# EAGLE design CMoy-Pro-V_1_0_0_2a (EAGLE 6.4)
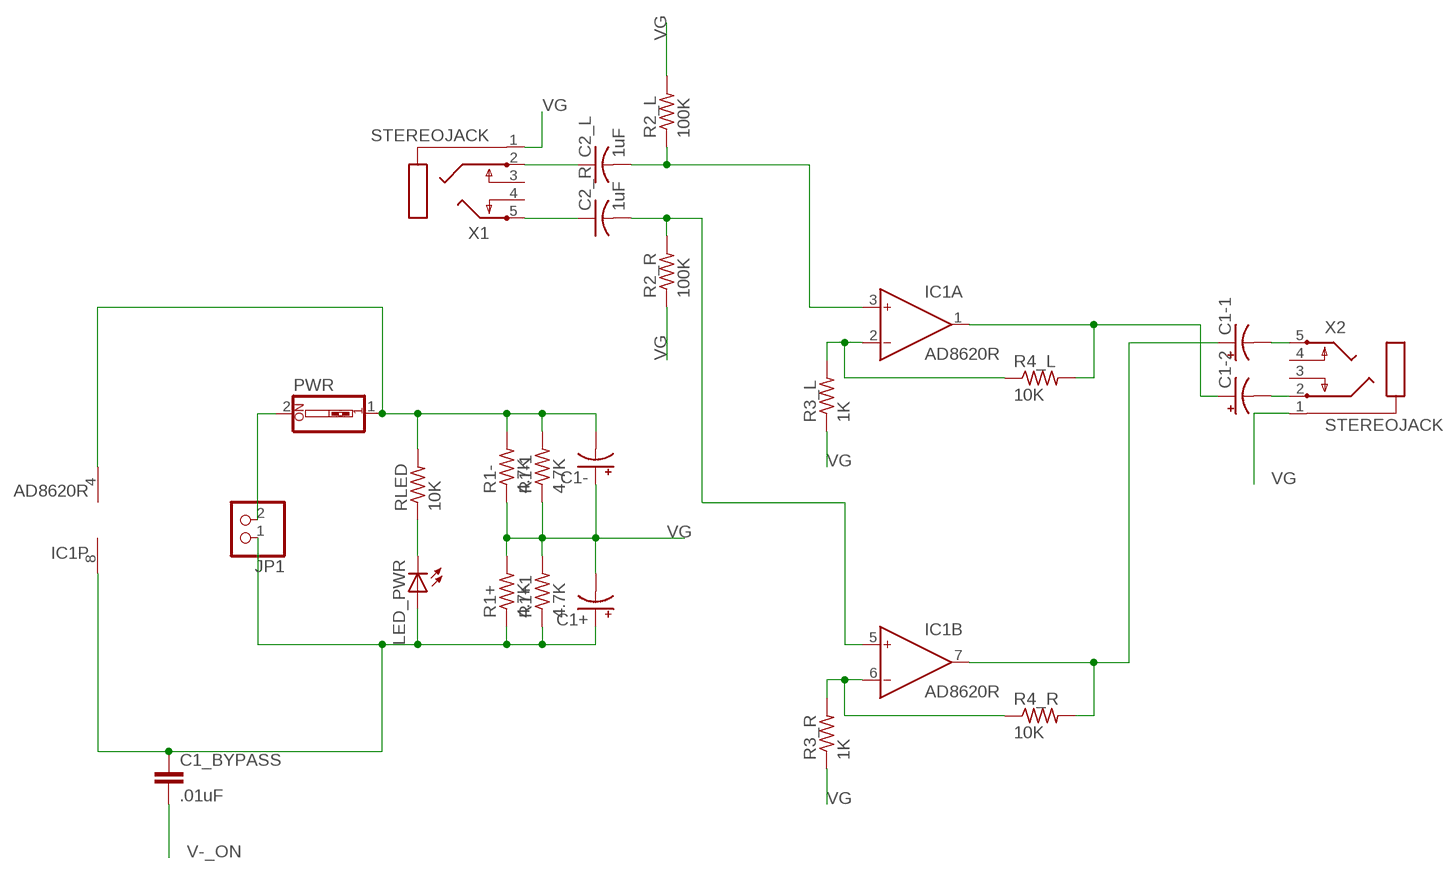
[diagram p0: schematic, sheet 1]

## Parts
C1+  CPOL-USE7.5-16  [E7,5-16]
C1-  CPOL-USE7.5-16  [E7,5-16]
C1-1  CPOL-USE7.5-16  [E7,5-16]
C1-2  CPOL-USE7.5-16  [E7,5-16]
C1_BYPASS  .01uF  C-EUC0402  [C0402]
C2_L  1uF  C-US075-042X103  [C075-042X103]
C2_R  1uF  C-US075-042X103  [C075-042X103]
IC1  AD8620R  [SO8]
JP1  PINHD-1X2  [1X02]
LED_PWR  LED3MM  [LED3MM]
PWR  SW_DIP-1  [EDG-01]
R1+  4.7K  R-US_0207/7  [0207/7]
R1+1  4.7K  R-US_0207/7  [0207/7]
R1-  4.7K  R-US_0207/7  [0207/7]
R1-1  4.7K  R-US_0207/7  [0207/7]
R2_L  100K  R-US_0207/7  [0207/7]
R2_R  100K  R-US_0207/7  [0207/7]
R3_L  1K  R-US_0207/7  [0207/7]
R3_R  1K  R-US_0207/7  [0207/7]
R4_L  10K  R-US_0207/7  [0207/7]
R4_R  10K  R-US_0207/7  [0207/7]
RLED  10K  R-US_0207/7  [0207/7]
X1  STEREOJACK  [STX3100]
X2  STEREOJACK  [STX3100]

## Nets
IN_R: C2_R.2 IC1.5(B:IN+) R2_R.2
N$1: C2_L.2 IC1.3(A:IN+) R2_L.1
N$2: C1-2.- X2.2
N$3: LED_PWR.K(C) RLED.1
N$4: C2_L.1 X1.2
N$5: IC1.2(A:IN-) R3_L.2 R4_L.1
N$6: IC1.6(B:IN-) R3_R.2 R4_R.1
N$7: C2_R.1 X1.5
N$8: C1-1.- X2.5
OUT_L: C1-2.+ IC1.1(A:OUT) R4_L.2
OUT_R: C1-1.+ IC1.7(B:OUT) R4_R.2
V+: C1+.+ C1_BYPASS.1 IC1.8(P:V+) JP1.1 LED_PWR.A R1+1.1 R1+.1
V-: JP1.2 PWR.2
V-_ON: C1-.- C1_BYPASS.2 IC1.4(P:V-) PWR.1 R1-1.2 R1-.2 RLED.2
VG: C1+.- C1-.+ R1+1.2 R1+.2 R1-1.1 R1-.1 R2_L.2 R2_R.1 R3_L.1 R3_R.1 X1.1 X2.1
Unconnected: X1.3 X1.4 X2.3 X2.4

## Library data of the parts
C1+ C1- C1-1 C1-2 = rcl:CPOL-US: POLARIZED CAPACITOR, American symbol
C1_BYPASS = rcl:C-EU: CAPACITOR, European symbol
C2_L C2_R = rcl:C-US: CAPACITOR, American symbol
IC1 = analog-devices:AD8620: Precision, Very Low Noise, Low Input Bias Current, Wide Bandwidth JFET Operational Amplifiers Source: http://www.analog.com/static/imported-files/data_sheets/AD8610_8620.pdf; MF: ALTERA CORPORATION; MPN: AD8620ARZ; OC_FARNELL: 9994386; OC_NEWARK: 59K6972
JP1 = pinhead:PINHD-1X2: PIN HEADER
LED_PWR = adafruit:LED: LED OSRAM: - CHIPLED LG R971, LG N971, LY N971, LG Q971, LY Q971, LO R971, LY R971 LH N974, LH R974 LS Q976, LO Q976, LY Q976 LO Q996 - Hyper CHIPLED LW Q18S LB Q993, LB Q99A, LB R99A - SideLED LS A670, LO A670, LY A670, LG A670, LP A670 LB A673, LV A673, LT A673, LW A673 LH A674 LY A675 LS A676, LA A676, LO A676, LY A676, LW A676 LS A679, LY A679, LG A679 - Hyper Micro SIDELED® LS Y876, LA Y876, LO Y876, LY Y876 LT Y87S - SmartLED LW L88C, LW L88S LB L89C, LB L89S, LG L890 LS L89K, LO L89K, LY L89K LS L896, LA L896, LO L896, LY L896 - TOPLED LS T670, LO T670, LY T670, LG T670, LP T670 LSG T670, LSP T670, LSY T670, LOP T670, LYG T670 LG T671, LOG T671, LSG T671 LB T673, LV T673, LT T673, LW T673 LH T674 LS T676, LA T676, LO T676, LY T676, LB T676, LH T676, LSB T676, LW T676 LB T67C, LV T67C, LT T67C, LS T67K, LO T67K, LY T67K, LW E67C LS E67B, LA E67B, LO E67B, LY E67B, LB E67C, LV E67C, LT E67C LW T67C LS T679, LY T679, LG T679 LS T770, LO T770, LY T770, LG T770, LP T770 LB T773, LV T773, LT T773, LW T773 LH T774 LS E675, LA E675, LY E675, LS T675 LS T776, LA T776, LO T776, LY T776, LB T776 LHGB T686 LT T68C, LB T68C - Hyper Mini TOPLED® LB M676 - Mini TOPLED Santana® LG M470 LS M47K, LO M47K, LY M47K Source: http://www.osram.convergy.de/
PWR = special:SW_DIP-1: DIP SWITCH
R1+ R1+1 R1- R1-1 R2_L R2_R R3_L R3_R R4_L R4_R RLED = rcl:R-US_: RESISTOR, American symbol
X1 X2 = adafruit:STEREOJACK: MIC/HEADPHONE JACK Stereo jack with two switches. Kycon STX3100, CUI SJ1-3555NG and/or 4UCon 05544

## Board
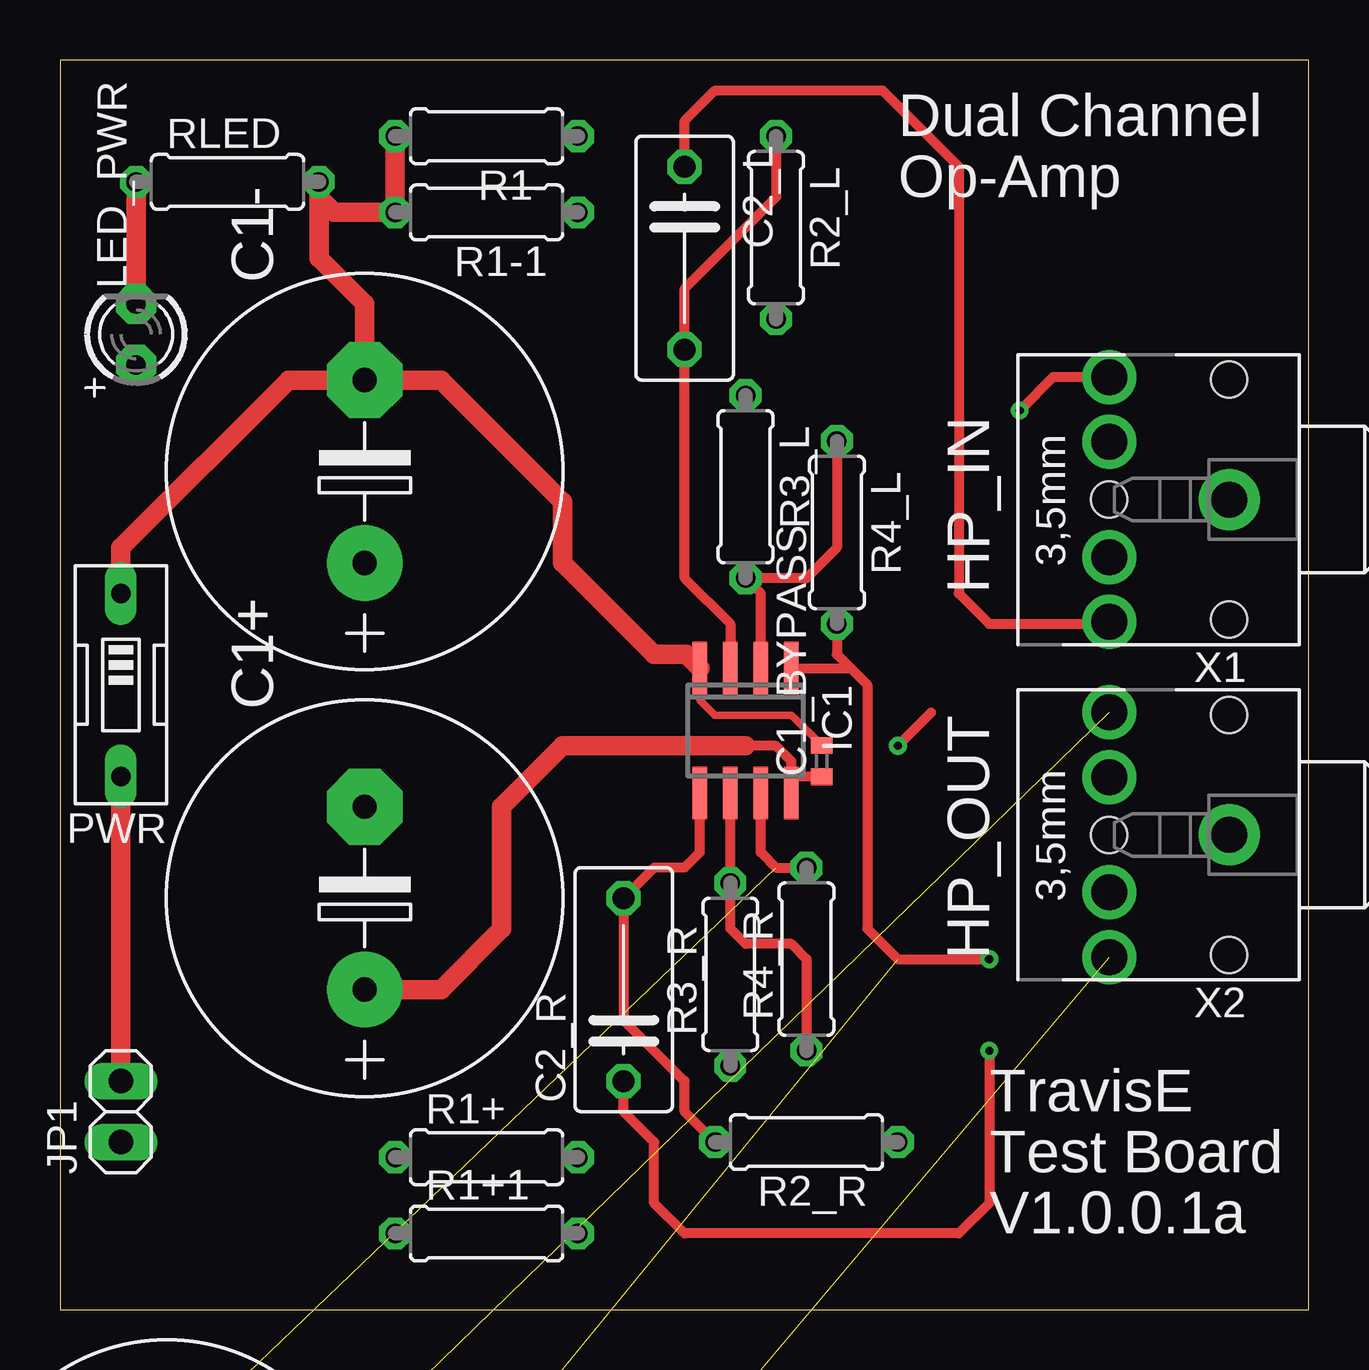
[diagram p1: board, top side]
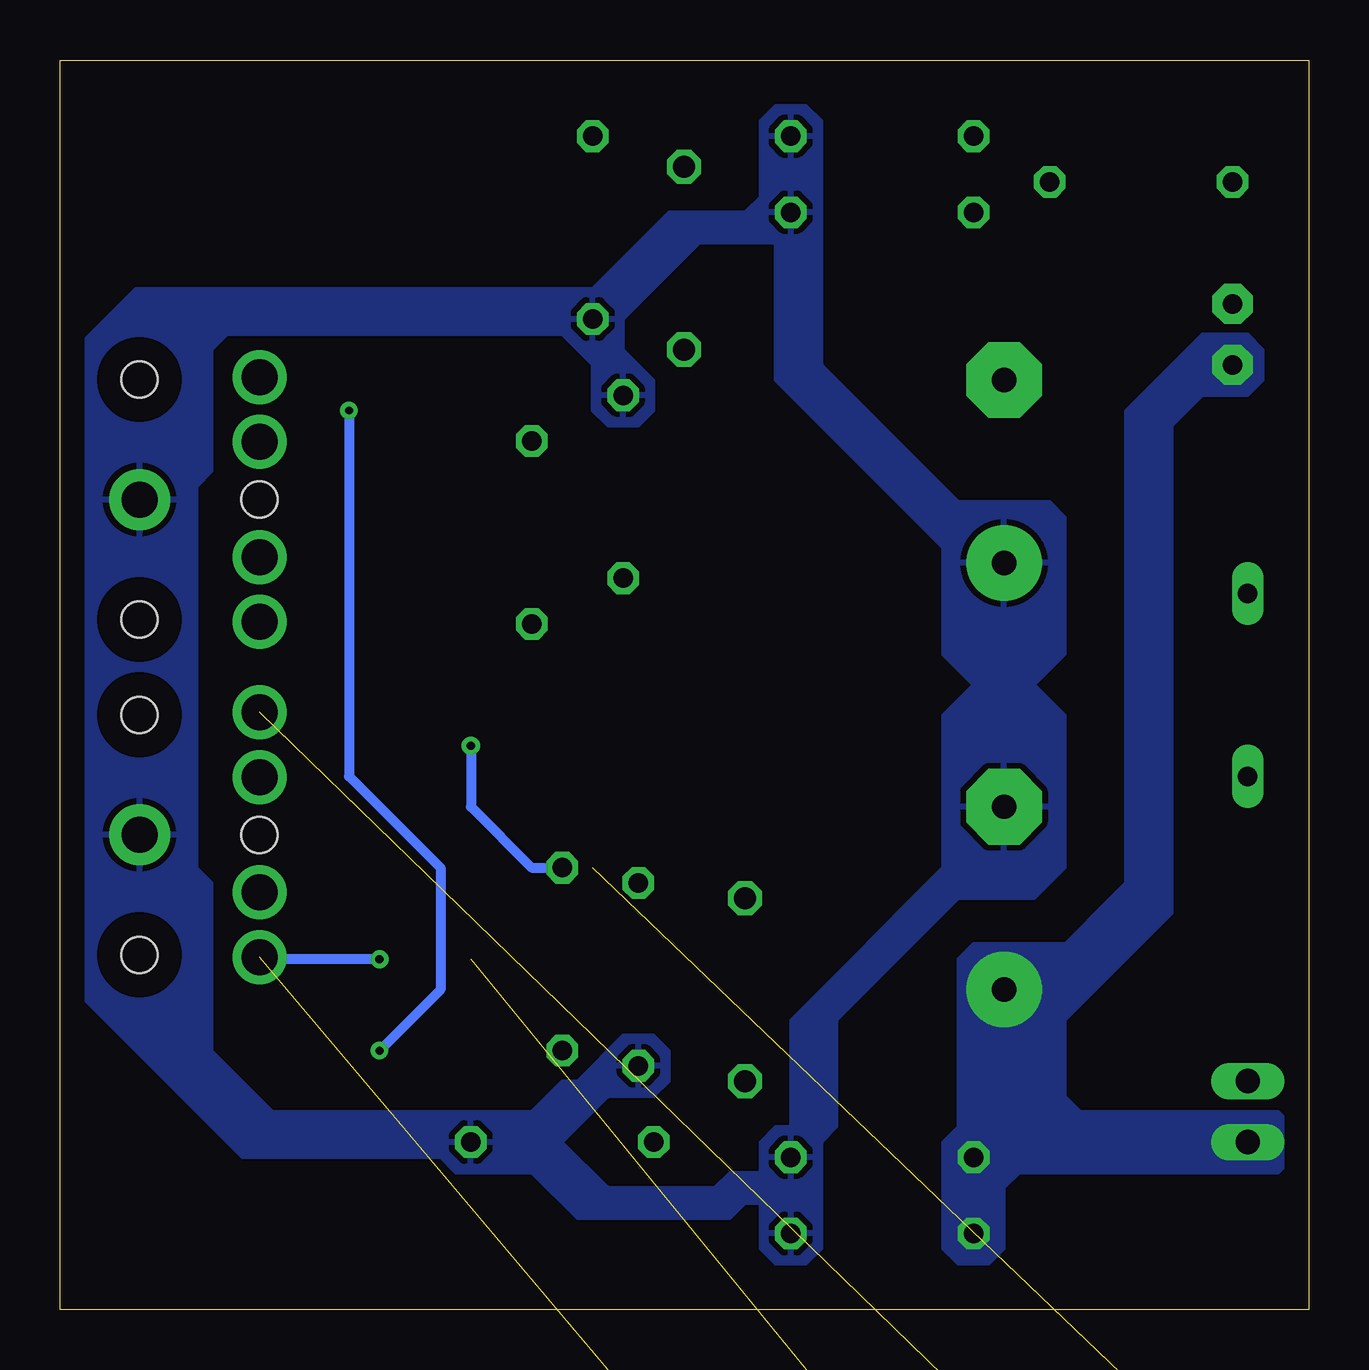
[diagram p2: board, bottom side, seen from below]

Size 52.05 x 52.07 mm. Coordinates in mm from the lower left corner, seen from the top.
Outline: 0,0 52.05,0 52.05,52.07 0,52.07 0,0
Copper layers (1*16): Top 0.035mm / dielectric 1.5mm / Bottom 0.035mm
Design rules "default": minimum track width 10mil, minimum drill 24mil, track to track 8mil, track to pad 8mil, pad to pad 8mil, via to via 8mil, smd to smd 8mil, copper to edge 40mil, drill to drill 8mil, minimum pad ring 10mil, minimum via ring 8mil, stop-mask expansion 4mil, vias tented up to drill 0mil, thermal gap 10mil

### Footprints (pad centres in the part's own frame; a part is rotated, then mirrored left to right if it is on the bottom)
E7,5-16 = drill 1.016 pad 3.15: + -3.81,0 | drill 1.016 pad 3.15 octagon: - 3.81,0
C0402 = smd 0.7 x 0.9: 1 -0.65,0; 2 0.65,0
C075-042X103 = drill 0.914 octagon: 1 -3.81,0; 2 3.81,0
SO8 = smd 0.6 x 2.2: 1 -1.905,-2.6; 2 -0.635,-2.6; 3 0.635,-2.6; 4 1.905,-2.6; 5 1.905,2.6; 6 0.635,2.6; 7 -0.635,2.6; 8 -1.905,2.6
1X02 = drill 1.016 long: 1 -1.27,0; 2 1.27,0
LED3MM = drill 0.813 pad 1.676 octagon: A -1.27,0; K 1.27,0
EDG-01 = drill 0.813 long: 1 0,-3.81; 2 0,3.81
0207/7 = drill 0.813 octagon: 1 -3.81,0; 2 3.81,0
STX3100 = drill 1.5 pad 2.54: 1 2.7,-0.1 | drill 1.5: 2 7.7,5; 3 7.7,2.3; 4 7.7,-2.5; 5 7.7,-5.2 | hole 1.5: 2.7,4.9; 2.7,-5.1; 7.7,-0.1

### Placement (x,y rotation side)
C1+  12.7,17.15 90 top
C1-  12.7,34.92 90 top
C1-1  4.45,-9.52 0 top  (outside the outline)
C1-2  4.45,-27.3 0 top  (outside the outline)
C1_BYPASS  31.75,22.86 90 top
C2_L  26.04,43.81 270 top
C2_R  23.5,13.34 90 top
IC1  28.58,24.13 180 top
JP1  2.54,8.26 90 top
LED_PWR  3.18,40.64 90 top
PWR  2.54,26.03 180 top
R1+  17.78,6.35 0 top
R1+1  17.78,3.18 0 top
R1-  17.78,48.9 180 top
R1-1  17.78,45.72 180 top
R2_L  29.84,45.09 270 top
R2_R  31.12,6.98 180 top
R3_L  28.58,34.29 270 top
R3_R  27.94,13.97 90 top
R4_L  32.39,32.39 270 top
R4_R  31.12,14.61 90 top
RLED  6.98,46.99 0 top
X1  51.44,33.66 180 top
X2  51.44,19.69 180 top

### Tracks (layer width: path | path; a pad name or v marks a point on that pad's centre or on a via)
IN_R
  Top 0.406: IC1.5 26.67,19.05 26.04,18.42 24.77,18.42 C2_R.2 23.5,12.06 26.04,9.53 26.04,8.26 R2_R.2
N$1
  Top 0.406: IC1.3 27.94,28.58 26.04,30.48 C2_L.2 26.04,42.55 29.84,46.36 R2_L.1
N$2  (1 unrouted)
N$3
  Top 0.813: RLED.1 LED_PWR.K
N$4
  Top 0.305: 43.66,28.58 X1.2
  Top 0.406: C2_L.1 26.04,49.53 27.31,50.8 34.29,50.8 37.47,47.62 37.47,29.84 38.73,28.58 43.66,28.58
N$5
  Top 0.406: R4_L.1 32.39,31.75 31.12,30.48 R3_L.2 29.21,29.84 IC1.2
N$6
  Top 0.406: IC1.6 R3_R.2 27.94,15.88 28.58,15.24 30.48,15.24 31.12,14.61 R4_R.1
N$7  (via drill 0.33)
  Top 0.406: X1.5 41.39,38.86 v40.01,37.47 | v38.73,10.8 38.73,4.45 37.47,3.18 26.04,3.18 24.77,4.45 24.77,6.98 23.5,8.26 C2_R.1
  Bottom 0.406: v40.01,37.47 40.01,22.23 36.2,18.42 36.2,13.34 v38.73,10.8
N$8  (1 unrouted)
OUT_L  (via drill 0.35)  (1 unrouted)
  Top 0.406: IC1.1 32.96,26.73 | 32.96,26.73 33.66,26.03 33.66,15.88 34.92,14.61 v38.73,14.61 | R4_L.2 32.39,27.31 32.96,26.73
  Bottom 0.406: v38.73,14.61 43.66,14.61
OUT_R  (via drill 0.35)  (1 unrouted)
  Top 0.406: IC1.7 29.21,19.05 29.84,18.42 R4_R.2 | 36.32,24.89 v34.92,23.5
  Bottom 0.406: v34.92,23.5 34.92,20.95 32.39,18.42 R4_R.2
V+
  Top 0.406: IC1.8 30.48,22.23 | 30.48,22.23 30.48,22.86 29.84,23.5 28.58,23.5 | C1_BYPASS.1 30.5,22.21 30.48,22.23
  Top 0.813: C1+.+ 15.88,13.34 18.42,15.88 18.42,20.95 20.95,23.5 28.58,23.5
  pour Bottom (no thermals): 9.53,8.26 1.27,8.26 0.64,7.62 0.64,6.35 1.27,5.72 12.07,5.72 12.7,5.08 12.7,2.54 13.34,1.91 14.61,1.91 15.24,2.54 15.24,6.98 14.61,7.62 14.61,14.61 13.97,15.24 9.53,15.24 10.16,14.61 10.16,8.89
  pour Bottom (no thermals): 10.8,11.43 10.8,14.61 7.62,17.78 7.62,37.47 4.45,40.64 2.54,40.64 1.91,40.01 1.91,38.73 2.54,38.1 4.45,38.1 5.72,36.83 5.72,16.51
V-
  Top 0.813: JP1.2 PWR.2
V-_ON
  Top 0.305: IC1.4 26.67,25.4 27.31,24.77 30.5,24.77 C1_BYPASS.2
  Top 0.813: PWR.1 2.54,31.75 9.53,38.73 C1-.- | C1-.- 12.7,41.91 10.8,43.81 10.8,46.36 | 10.8,46.36 RLED.2 | 10.8,46.36 11.43,45.72 R1-1.2 R1-.2 | C1-.- 15.88,38.73 20.95,33.66 20.95,31.12 24.77,27.31 26.09,27.31 IC1.4
VG
  pour Bottom: 30.48,40.64 45.08,40.64 45.72,40.01 45.72,34.92 46.36,34.29 50.8,34.29 51.44,34.92 51.44,40.01 48.89,42.55 30.48,42.55
  pour Bottom: 21.59,44.45 25.4,44.45 28.58,41.28 29.84,41.28 29.84,42.55 26.67,45.72 23.5,45.72 22.86,46.36 21.59,46.36
  pour Bottom: 10.16,27.31 11.43,26.03 13.97,26.03 15.24,27.31 15.24,31.75 22.23,38.73 22.23,45.09 20.32,45.09 20.32,39.37 14.61,33.66 10.8,33.66 10.16,33.02
  pour Bottom: 27.31,38.73 27.31,37.47 27.94,36.83 29.21,36.83 29.84,37.47 29.84,39.37 31.12,40.64 31.12,41.91 30.48,42.55 29.21,42.55 28.58,41.91 28.58,40.01
  pour Bottom: 46.36,34.92 47.63,36.2 50.17,36.2 51.44,34.92 51.44,18.42 50.17,17.15 47.63,17.15 46.36,18.42
  pour Bottom: 10.16,24.77 11.43,26.03 13.97,26.03 15.24,24.77 15.24,18.42 21.59,12.06 21.59,6.98 20.32,6.98 19.69,7.62 19.69,12.06 14.61,17.15 11.43,17.15 10.16,18.42
  pour Bottom: 34.92,8.26 43.18,8.26 45.72,10.8 45.72,17.78 46.36,18.42 50.8,18.42 51.44,17.78 51.44,13.34 44.45,6.35 34.92,6.35
  pour Bottom: 28.58,11.43 27.31,11.43 26.67,10.8 26.67,9.53 27.31,8.89 29.21,8.89 32.39,5.72 35.56,5.72 36.2,6.35 36.2,7.62 35.56,8.26 32.39,8.26 31.12,9.53 30.48,9.53
  pour Bottom: 20.95,5.72 24.13,5.72 24.77,5.08 29.21,5.08 31.12,6.98 36.2,6.98 32.39,5.72 30.48,3.81 24.13,3.81 23.5,4.45 20.95,4.45
  pour Bottom: 20.32,6.98 20.95,7.62 22.23,7.62 22.86,6.98 22.86,2.54 22.23,1.91 20.95,1.91 20.32,2.54
  pour Bottom: 20.32,49.53 20.95,50.17 22.23,50.17 22.86,49.53 22.86,45.09 22.23,44.45 20.95,44.45 20.32,45.09

### Text on the board
tPlace: Dual Channel | Op-Amp | HP_IN | HP_OUT | TravisE | Test Board | V1.0.0.1a